# EAGLE design AudioBoard (EAGLE 6.2)
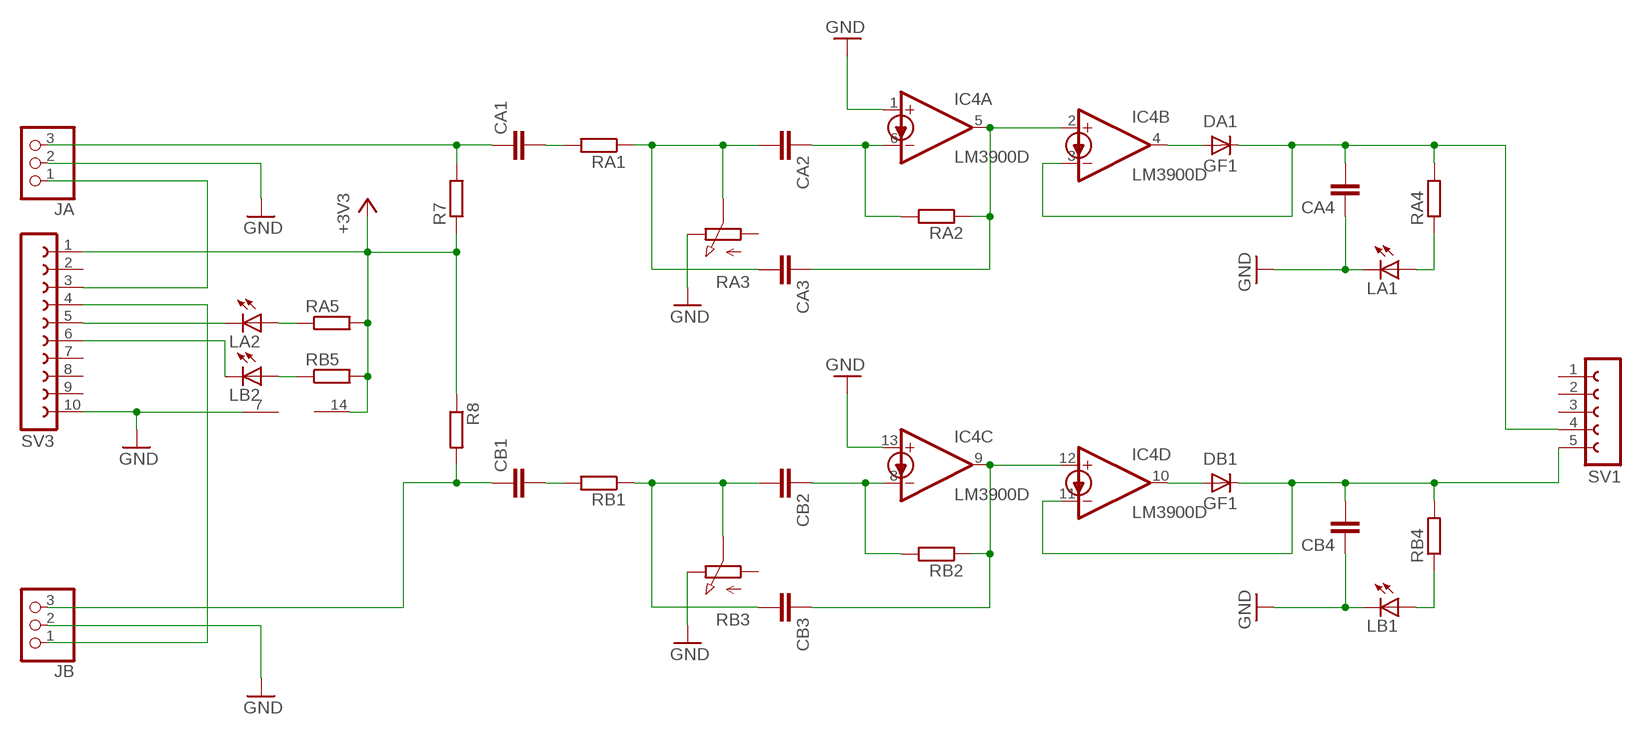
[diagram p0: schematic, sheet 1]

## Parts
CA1  C-EUC0402K  [C0402K]
CA2  C-EUC0402K  [C0402K]
CA3  C-EUC0402K  [C0402K]
CA4  C-EUC0402K  [C0402K]
CB1  C-EUC0402K  [C0402K]
CB2  C-EUC0402K  [C0402K]
CB3  C-EUC0402K  [C0402K]
CB4  C-EUC0402K  [C0402K]
DA1  GF1  [SMA-DO214AC]
DB1  GF1  [SMA-DO214AC]
IC4  LM3900D  [SO14]
JA  PINHD-1X3/90  [1X03/90]
JB  PINHD-1X3/90  [1X03/90]
LA1  LEDCHIPLED_0805  [CHIPLED_0805]
LA2  LEDCHIPLED_0805  [CHIPLED_0805]
LB1  LEDCHIPLED_0805  [CHIPLED_0805]
LB2  LEDCHIPLED_0805  [CHIPLED_0805]
R7  R-EU_R0402  [R0402]
R8  R-EU_R0402  [R0402]
RA1  R-EU_R0402  [R0402]
RA2  R-EU_R0402  [R0402]
RA3  PC25  [PC25]
RA4  R-EU_R0402  [R0402]
RA5  R-EU_R0402  [R0402]
RB1  R-EU_R0402  [R0402]
RB2  R-EU_R0402  [R0402]
RB3  PC25  [PC25]
RB4  R-EU_R0402  [R0402]
RB5  R-EU_R0402  [R0402]
SV1  FE05-1  [FE05-1]
SV3  FE10-1  [FE10]

## Nets
+3V3: IC4.14(P:V+) R7.1 R8.1 RA5.2 RB5.2 SV3.1
GND: CA4.1 CB4.1 IC4.1(A:+IN) IC4.7(P:GND) IC4.13(C:+IN) JA.2 JB.2 LA1.C LB1.C RA3.E RB3.E SV3.10
N$1: LA2.C SV3.5
N$2: LA2.A RA5.1
N$3: LB1.A RB4.1
N$4: JB.1 SV3.4
N$6: CB2.1 IC4.8(C:-IN) RB2.2
N$7: CB3.1 IC4.9(C:OUT) IC4.12(D:+IN) RB2.1
N$8: CB1.2 RB1.2
N$9: JA.1 SV3.3
N$10: CB1.1 JB.3 R8.2
N$11: CB4.2 DB1.K(C) IC4.11(D:-IN) RB4.2 SV1.5
N$12: CB2.2 CB3.2 RB1.1 RB3.S
N$13: DB1.A IC4.10(D:OUT)
N$14: LB2.A RB5.1
N$15: CA1.1 JA.3 R7.2
N$16: CA4.2 DA1.K(C) IC4.3(B:-IN) RA4.2 SV1.4
N$17: DA1.A IC4.4(B:OUT)
N$18: CA2.2 CA3.2 RA1.1 RA3.S
N$19: CA2.1 IC4.6(A:-IN) RA2.2
N$20: CA3.1 IC4.2(B:+IN) IC4.5(A:OUT) RA2.1
N$21: CA1.2 RA1.2
N$22: LB2.C SV3.6
N$23: LA1.A RA4.1
Unconnected: RA3.A RB3.A SV1.1 SV1.2 SV1.3 SV3.2 SV3.7 SV3.8 SV3.9

## Library data of the parts
CA1-CA4 CB1-CB4 = rcl:C-EU: CAPACITOR, European symbol
DA1 DB1 = diode:GF1: DIODE
IC4 = linear:LM3900: OP AMP
JA JB = pinhead:PINHD-1X3: PIN HEADER
LA1 LA2 LB1 LB2 = led:LED: LED OSRAM: - CHIPLED LG R971, LG N971, LY N971, LG Q971, LY Q971, LO R971, LY R971 LH N974, LH R974 LS Q976, LO Q976, LY Q976 LO Q996 - Hyper CHIPLED LW Q18S LB Q993, LB Q99A, LB R99A - SideLED LS A670, LO A670, LY A670, LG A670, LP A670 LB A673, LV A673, LT A673, LW A673 LH A674 LY A675 LS A676, LA A676, LO A676, LY A676, LW A676 LS A679, LY A679, LG A679 - Hyper Micro SIDELED® LS Y876, LA Y876, LO Y876, LY Y876 LT Y87S - SmartLED LW L88C, LW L88S LB L89C, LB L89S, LG L890 LS L89K, LO L89K, LY L89K LS L896, LA L896, LO L896, LY L896 - TOPLED LS T670, LO T670, LY T670, LG T670, LP T670 LSG T670, LSP T670, LSY T670, LOP T670, LYG T670 LG T671, LOG T671, LSG T671 LB T673, LV T673, LT T673, LW T673 LH T674 LS T676, LA T676, LO T676, LY T676, LB T676, LH T676, LSB T676, LW T676 LB T67C, LV T67C, LT T67C, LS T67K, LO T67K, LY T67K, LW E67C LS E67B, LA E67B, LO E67B, LY E67B, LB E67C, LV E67C, LT E67C LW T67C LS T679, LY T679, LG T679 LS T770, LO T770, LY T770, LG T770, LP T770 LB T773, LV T773, LT T773, LW T773 LH T774 LS E675, LA E675, LY E675, LS T675 LS T776, LA T776, LO T776, LY T776, LB T776 LHGB T686 LT T68C, LB T68C - Hyper Mini TOPLED® LB M676 - Mini TOPLED Santana® LG M470 LS M47K, LO M47K, LY M47K Source: http://www.osram.convergy.de LUXEON: - LUMILED® LXK2-PW12-R00, LXK2-PW12-S00, LXK2-PW14-U00, LXK2-PW14-V00 LXK2-PM12-R00, LXK2-PM12-S00, LXK2-PM14-U00 LXK2-PE12-Q00, LXK2-PE12-R00, LXK2-PE12-S00, LXK2-PE14-T00, LXK2-PE14-U00 LXK2-PB12-K00, LXK2-PB12-L00, LXK2-PB12-M00, LXK2-PB14-N00, LXK2-PB14-P00, LXK2-PB14-Q00 LXK2-PR12-L00, LXK2-PR12-M00, LXK2-PR14-Q00, LXK2-PR14-R00 LXK2-PD12-Q00, LXK2-PD12-R00, LXK2-PD12-S00 LXK2-PH12-R00, LXK2-PH12-S00 LXK2-PL12-P00, LXK2-PL12-Q00, LXK2-PL12-R00 Source: www.luxeon.com KINGBRIGHT: KA-3528ASYC Source: www.kingbright.com
R7 R8 RA1 RA2 RA4 RA5 RB1 RB2 RB4 RB5 = rcl:R-EU_: RESISTOR, European symbol
RA3 RB3 = pot-vitrohm:PC25: VITROHM POTENTIOMETER; MF: CLAROSTAT; MPN: 308NPC25KS; OC_FARNELL: 1440998; OC_NEWARK: 03F7518
SV1 = con-lsta:FE05-1: FEMALE HEADER; OC_FARNELL: unknown; OC_NEWARK: unknown
SV3 = con-lsta:FE10-1: FEMALE HEADER; OC_FARNELL: unknown; OC_NEWARK: unknown

## Board
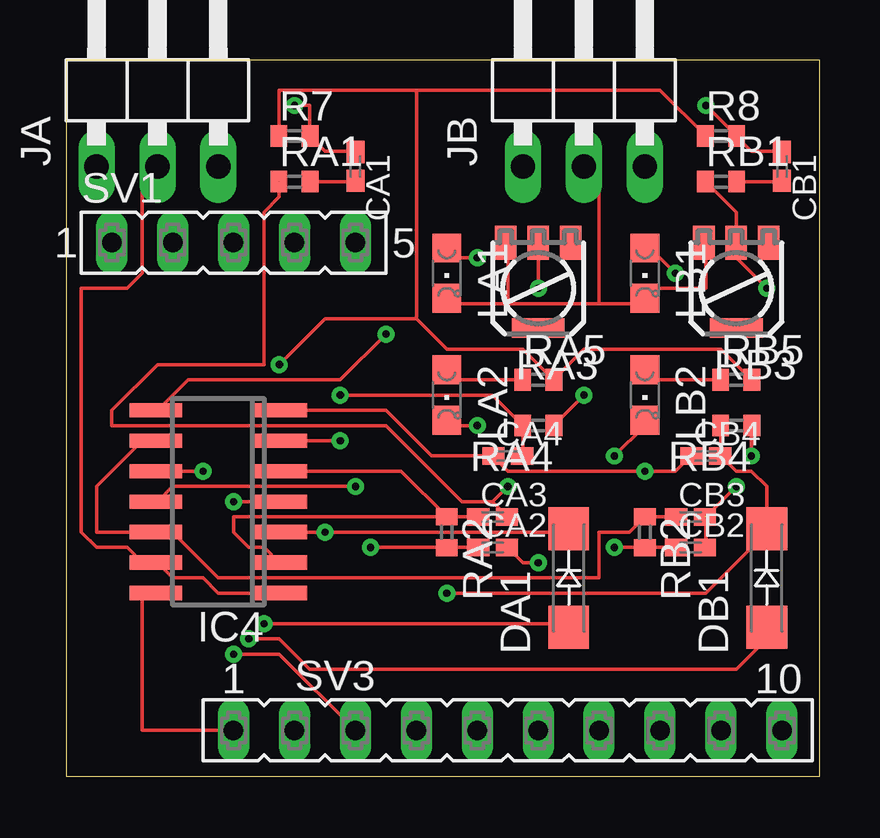
[diagram p1: board, top side]
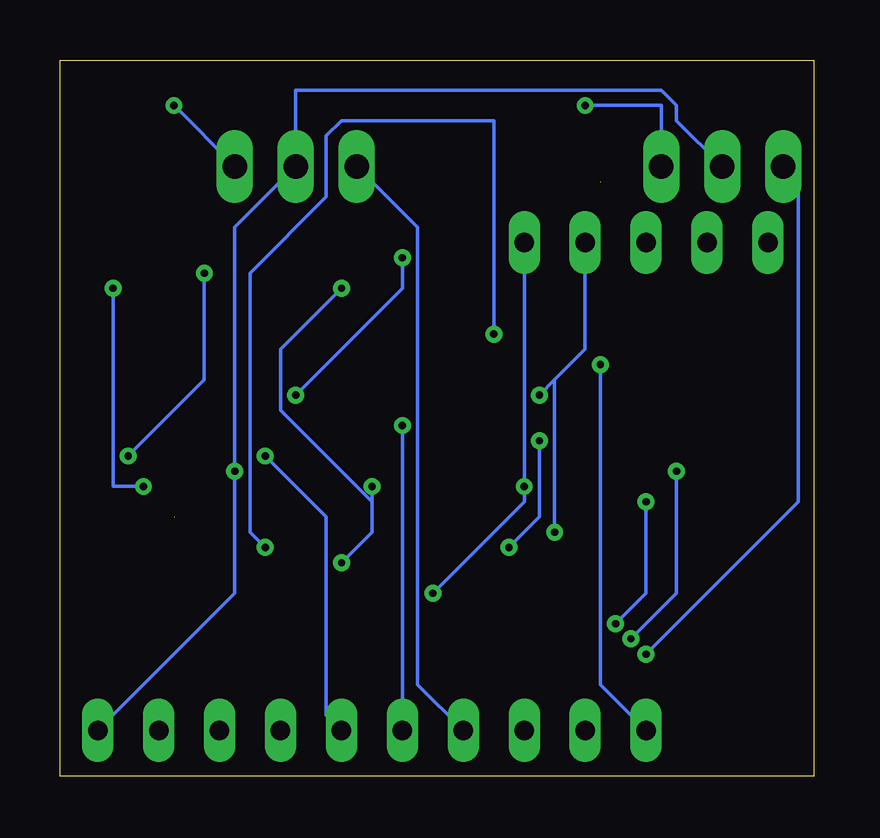
[diagram p2: board, bottom side, seen from below]

Size 31.42 x 29.83 mm. Coordinates in mm from the lower left corner, seen from the top.
Outline: 0,0 31.42,0 31.42,29.83 0,29.83 0,0
Copper layers (1*16): Top 0.035mm / dielectric 1.5mm / Bottom 0.035mm
Design rules: minimum track width 0.15mm, minimum drill 0.3mm, track to track 0.17mm, track to pad 0.17mm, pad to pad 0.17mm, via to via 0.17mm, smd to smd 0.17mm, copper to edge 1mil, drill to drill 0.17mm, minimum pad ring 10mil, minimum via ring 8mil, stop-mask expansion 4mil, vias tented up to drill 0.32mm, thermal gap 10mil

### Footprints (pad centres in the part's own frame; a part is rotated, then mirrored left to right if it is on the bottom)
C0402K = smd 0.925 x 0.74: 1 -0.6,0; 2 0.6,0
SMA-DO214AC = smd 1.8 x 1.7: A -2.05,0; K 2.05,0
SO14 = smd 0.6 x 2.2: 1 -3.81,-2.6; 2 -2.54,-2.6; 3 -1.27,-2.6; 4 0,-2.6; 5 1.27,-2.6; 6 2.54,-2.6; 7 3.81,-2.6; 8 3.81,2.6; 9 2.54,2.6; 10 1.27,2.6; 11 0,2.6; 12 -1.27,2.6; 13 -2.54,2.6; 14 -3.81,2.6
1X03/90 = drill 1.016 long: 1 -2.54,-3.81; 2 0,-3.81; 3 2.54,-3.81
CHIPLED_0805 = smd 1.2 x 1.2: A 0,-1.05; C 0,1.05
R0402 = smd 0.7 x 0.9: 1 -0.65,0; 2 0.65,0
PC25 = smd 2.2 x 0.8: 4 0,1.65 | smd 0.9 x 1.4: A -1.35,-1.9; E 1.35,-1.9; S 0,-1.9
FE05-1 = drill 0.813 long: 1 -5.08,0; 2 -2.54,0; 3 0,0; 4 2.54,0; 5 5.08,0
FE10 = drill 0.813 long: 1 -11.43,0; 2 -8.89,0; 3 -6.35,0; 4 -3.81,0; 5 -1.27,0; 6 1.27,0; 7 3.81,0; 8 6.35,0; 9 8.89,0; 10 11.43,0

### Placement (x,y rotation side)
CA1  12.07,25.4 270 top
CA2  17.78,9.52 0 top
CA3  17.78,10.8 0 top
CA4  18.41,13.34 0 top
CB1  29.85,25.4 270 top
CB2  26.04,9.52 0 top
CB3  26.04,10.8 0 top
CB4  26.67,13.34 0 top
DA1  20.96,8.26 90 top
DB1  29.21,8.26 90 top
IC4  6.35,11.43 90 top
JA  3.81,29.21 0 top
JB  21.59,29.21 0 top
LA1  15.88,20.95 180 top
LA2  15.88,15.88 180 top
LB1  24.13,20.95 180 top
LB2  24.13,15.88 180 top
R7  9.53,26.67 0 top
R8  27.31,26.67 0 top
RA1  9.53,24.77 0 top
RA2  15.88,10.16 270 top
RA3  19.68,20.32 180 top
RA4  19.68,14.6 180 top
RA5  19.68,16.51 0 top
RB1  27.31,24.77 0 top
RB2  24.13,10.16 270 top
RB3  27.94,20.32 180 top
RB4  27.94,14.6 180 top
RB5  27.94,16.51 0 top
SV1  6.98,22.22 0 top
SV3  18.41,1.91 0 top

### Tracks (layer width: path | path; a pad name or v marks a point on that pad's centre or on a via)
+3V3  (via drill 0.3)
  Top 0.15: SV3.1 3.18,1.91 3.18,7.62 IC4.14 | 20.32,16.51 21.59,17.78 27.31,17.78 RB5.2 | 14.61,28.58 24.77,28.58 26.67,26.67 R8.1 | 14.61,28.58 8.89,28.58 8.89,26.67 R7.1 | 20.32,16.51 19.05,17.78 15.88,17.78 14.61,19.05 | 14.61,28.58 14.61,19.05 | 20.32,16.51 RA5.2 | v8.89,17.14 10.8,19.05 14.61,19.05
  Bottom 0.15: SV3.1 8.89,3.81 v8.89,17.14
GND  (via drill 0.3)
  Top 0.15: 8.89,15.24 IC4.7 13.34,15.24 15.24,13.34 17.78,13.34 | 17.78,13.34 18.41,12.7 v24.13,12.7 25.4,12.7 26.04,13.34 CB4.1 | 17.78,13.34 CA4.1 | 22.23,19.69 24.13,19.69 LB1.C 24.13,20.32 26.67,20.32 26.67,21.59 RB3.E | 22.23,19.69 18.41,19.69 | 18.41,19.69 15.88,19.69 LA1.C | 18.41,19.69 18.41,21.59 RA3.E | IC4.1 6.35,7.62 5.71,8.26 4.45,8.26 3.81,8.89 IC4.13 3.18,8.89 2.54,9.52 1.27,9.52 0.63,10.16 0.63,20.32 2.54,20.32 3.18,20.95 3.18,25.4 JA.2 | 22.23,19.69 22.23,25.4 JB.2
  Bottom 0.15: SV3.10 24.13,7.62 v24.13,12.7 24.13,22.86 JB.2 21.59,28.58 6.35,28.58 5.71,27.94 5.71,27.31 JA.2
N$1  (via drill 0.3)
  Top 0.15: v17.14,14.6 15.88,14.6 LA2.C
  Bottom 0.15: SV3.5 v17.14,14.6
N$2
  Top 0.15: 19.05,16.51 RA5.1 15.88,16.51 LA2.A
N$3  (via drill 0.3)
  Top 0.15: v28.57,13.34 RB4.1 | v25.4,20.95 24.77,21.59 24.13,21.59 LB1.A
  Bottom 0.15: v28.57,13.34 25.4,16.51 v25.4,20.95
N$4
  Bottom 0.15: SV3.4 16.51,3.81 16.51,22.86 JB.1
N$6  (via drill 0.3)
  Top 0.15: CB2.1 24.13,9.52 | v22.86,9.52 24.13,9.52 | v13.34,18.42 11.43,16.51 5.08,16.51 3.81,15.24 IC4.8 | 24.13,9.52 RB2.2
  Bottom 0.15: v22.86,9.52 23.5,10.16 23.5,20.95 20.32,24.13 20.32,26.67 19.68,27.31 13.34,27.31 v13.34,18.42
N$7
  Top 0.15: CB3.1 RB2.1 | RB2.1 23.5,10.16 22.23,10.16 22.23,8.26 6.35,8.26 4.45,10.16 IC4.12 1.27,10.16 1.27,12.06 3.18,13.97 IC4.9 | RB2.1
N$8
  Top 0.15: 27.94,24.77 RB1.2 29.85,24.77 CB1.2
N$9  (via drill 0.3)
  Top 0.15: SV3.3 8.89,5.08 v6.98,5.08
  Bottom 0.15: v6.98,5.08 0.63,11.43 0.63,24.77 JA.1
N$10  (via drill 0.3)
  Top 0.15: 27.94,26.67 28.57,26.03 29.85,26.03 CB1.1 | v26.67,27.94 27.94,26.67 | 27.94,26.67 R8.2
  Bottom 0.15: JB.3 v26.67,27.94
N$11  (via drill 0.3)
  Top 0.15: 27.31,13.34 RB4.2 | 27.31,13.34 27.94,12.7 28.57,12.7 29.21,12.06 DB1.K 29.21,10.16 26.67,7.62 v15.88,7.62 | 27.31,13.34 CB4.2 | v12.07,12.06 4.45,12.06 3.81,11.43 IC4.11
  Bottom 0.15: SV1.5 v12.07,12.06 12.07,11.43 v15.88,7.62
N$12  (via drill 0.3)  (1 unrouted)
  Top 0.15: CB2.2 26.67,9.52 26.67,10.8 v27.94,12.06 | RB1.1 26.67,24.77 27.94,23.5 RB3.S 27.94,21.59 v29.21,20.32
  Bottom 0.15: v27.94,12.06 29.21,12.06 v29.21,20.32
N$13  (via drill 0.3)
  Top 0.15: v7.62,5.72 8.89,5.72 10.16,4.45 27.94,4.45 29.21,5.72 DB1.A | IC4.10 v5.71,12.7
  Bottom 0.15: v7.62,5.72 5.71,7.62 v5.71,12.7
N$14
  Top 0.15: RB5.1 24.13,16.51 LB2.A
N$15  (via drill 0.3)
  Top 0.15: 10.16,26.67 10.8,26.03 12.07,26.03 CA1.1 | 10.16,26.67 10.16,27.94 v9.53,27.94 | 10.16,26.67 R7.2
  Bottom 0.15: v9.53,27.94 6.35,27.94 JA.3
N$16  (via drill 0.3)
  Top 0.15: IC4.3 v10.8,10.16 20.96,10.16 DA1.K | 19.05,14.6 19.05,13.34 CA4.2 | 19.05,14.6 17.78,15.88 v11.43,15.88 | 19.05,14.6 RA4.2
  Bottom 0.15: 10.8,16.51 9.53,17.78 SV1.4 | 10.8,16.51 v11.43,15.88 | 10.8,16.51 v10.8,10.16
N$17  (via drill 0.3)
  Top 0.15: v8.26,6.35 20.96,6.35 DA1.A | IC4.4 v6.98,11.43
  Bottom 0.15: v8.26,6.35 6.98,7.62 v6.98,11.43
N$18  (via drill 0.3)  (1 unrouted)
  Top 0.15: 8.89,24.77 8.89,24.13 8.26,23.5 8.26,17.14 3.81,17.14 1.91,15.24 1.91,14.6 13.34,14.6 16.51,11.43 17.78,11.43 | 17.78,11.43 18.41,10.8 CA3.2 | v19.68,8.89 19.05,8.89 18.41,9.52 CA2.2 | 17.78,11.43 v18.41,12.06 | v19.68,20.32 RA3.S
  Bottom 0.15: v19.68,8.89 18.41,10.16 18.41,11.43 | v18.41,12.06 18.41,11.43 | v19.68,20.32 22.23,17.78 22.23,15.24 18.41,11.43
N$19  (via drill 0.3)
  Top 0.15: CA2.1 15.88,9.52 | v12.7,9.52 15.88,9.52 | IC4.6 v11.43,13.97 | 15.88,9.52 RA2.2
  Bottom 0.15: v12.7,9.52 11.43,10.8 v11.43,13.97
N$20
  Top 0.15: CA3.1 RA2.1 | RA2.1 13.97,12.7 IC4.5 | RA2.1 6.98,10.8 6.98,10.16 7.62,9.52 8.26,9.52 8.89,8.89 IC4.2 | RA2.1
N$21
  Top 0.15: 10.16,24.77 RA1.2 12.07,24.77 CA1.2
N$22  (via drill 0.3)
  Top 0.15: v22.86,13.34 24.13,14.6 LB2.C
  Bottom 0.15: v22.86,13.34 20.32,10.8 20.32,2.54 SV3.6
N$23  (via drill 0.3)
  Top 0.15: v21.59,15.88 20.32,14.6 RA4.1 | v17.14,21.59 15.88,21.59 LA1.A
  Bottom 0.15: v21.59,15.88 17.14,20.32 v17.14,21.59